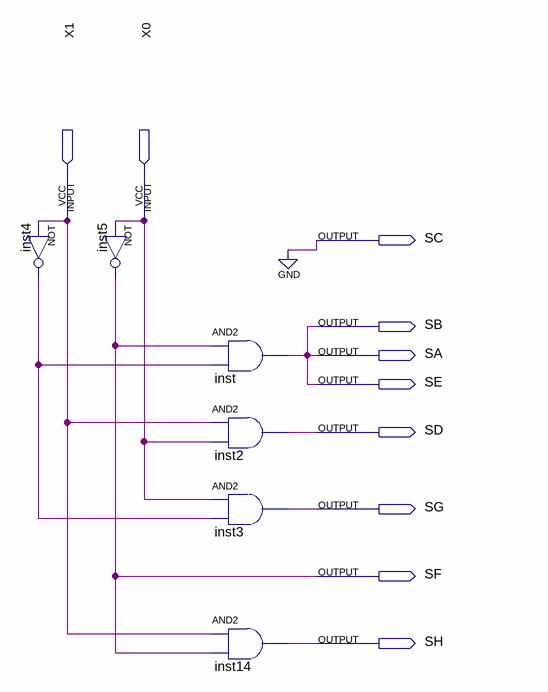
[diagram p0: schematic sheet]
// Quartus schematic Decodificador2x8.bdf as structural Verilog: 6 symbols, 10 pins
module Decodificador2x8 (
  input  X1,
  input  X0,
  output SC,
  output SB,
  output SA,
  output SE,
  output SD,
  output SG,
  output SF,
  output SH
);

  wire inst4_out;

  not inst4 (inst4_out, X1);
  not inst5 (SF, X0);
  and inst (SA, SF, inst4_out);
  and inst2 (SD, X1, X0);
  and inst3 (SG, X0, inst4_out);
  and inst14 (SH, X1, SF);

  assign SB = SA;
  assign SC = 1'b0;
  assign SE = SA;
endmodule
